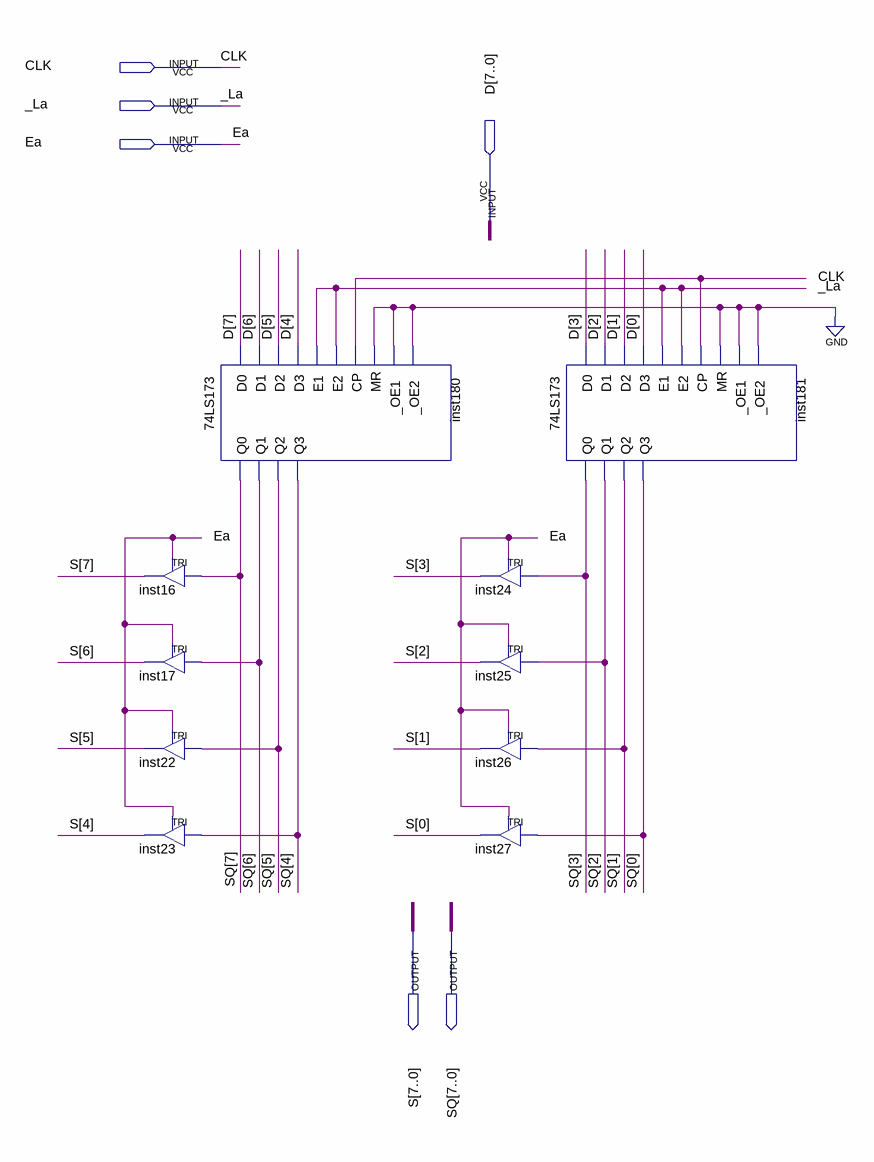
[diagram p0: schematic sheet]
// Quartus schematic Acumulador.bdf as structural Verilog: 10 symbols, 6 pins
module Acumulador (
  input  CLK,
  input  _La,
  input  Ea,
  input  [7:0] D,
  output [7:0] S,
  output [7:0] SQ
);

  TRI inst16 (.IN(SQ[7]), .OE(Ea), .OUT(S[7]));
  TRI inst17 (.IN(SQ[6]), .OE(Ea), .OUT(S[6]));
  TRI inst22 (.IN(SQ[5]), .OE(Ea), .OUT(S[5]));
  TRI inst23 (.IN(SQ[4]), .OE(Ea), .OUT(S[4]));
  \74LS173  inst180 (
    .D0(D[7]), .D1(D[6]), .D2(D[5]), .D3(D[4]), .E1(_La), .E2(_La), .CP(CLK), .MR(1'b0), ._OE1(1'b0),
    ._OE2(1'b0), .Q0(SQ[7]), .Q1(SQ[6]), .Q2(SQ[5]), .Q3(SQ[4]));
  TRI inst24 (.IN(SQ[3]), .OE(Ea), .OUT(S[3]));
  TRI inst25 (.IN(SQ[2]), .OE(Ea), .OUT(S[2]));
  TRI inst26 (.IN(SQ[1]), .OE(Ea), .OUT(S[1]));
  TRI inst27 (.IN(SQ[0]), .OE(Ea), .OUT(S[0]));
  \74LS173  inst181 (
    .D0(D[3]), .D1(D[2]), .D2(D[1]), .D3(D[0]), .E1(_La), .E2(_La), .CP(CLK), .MR(1'b0), ._OE1(1'b0),
    ._OE2(1'b0), .Q0(SQ[3]), .Q1(SQ[2]), .Q2(SQ[1]), .Q3(SQ[0]));
endmodule
